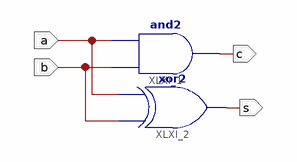
[diagram p0: schematic sheet 1]
// Xilinx ISE schematic half_adder.sch (spartan6) as structural Verilog: 2 symbols, 4 ports
module half_adder (
  input  a,
  input  b,
  output c,
  output s
);

  and XLXI_1 (c, b, a);
  xor XLXI_2 (s, b, a);
endmodule
